# Altium project FlightController.PrjPcb
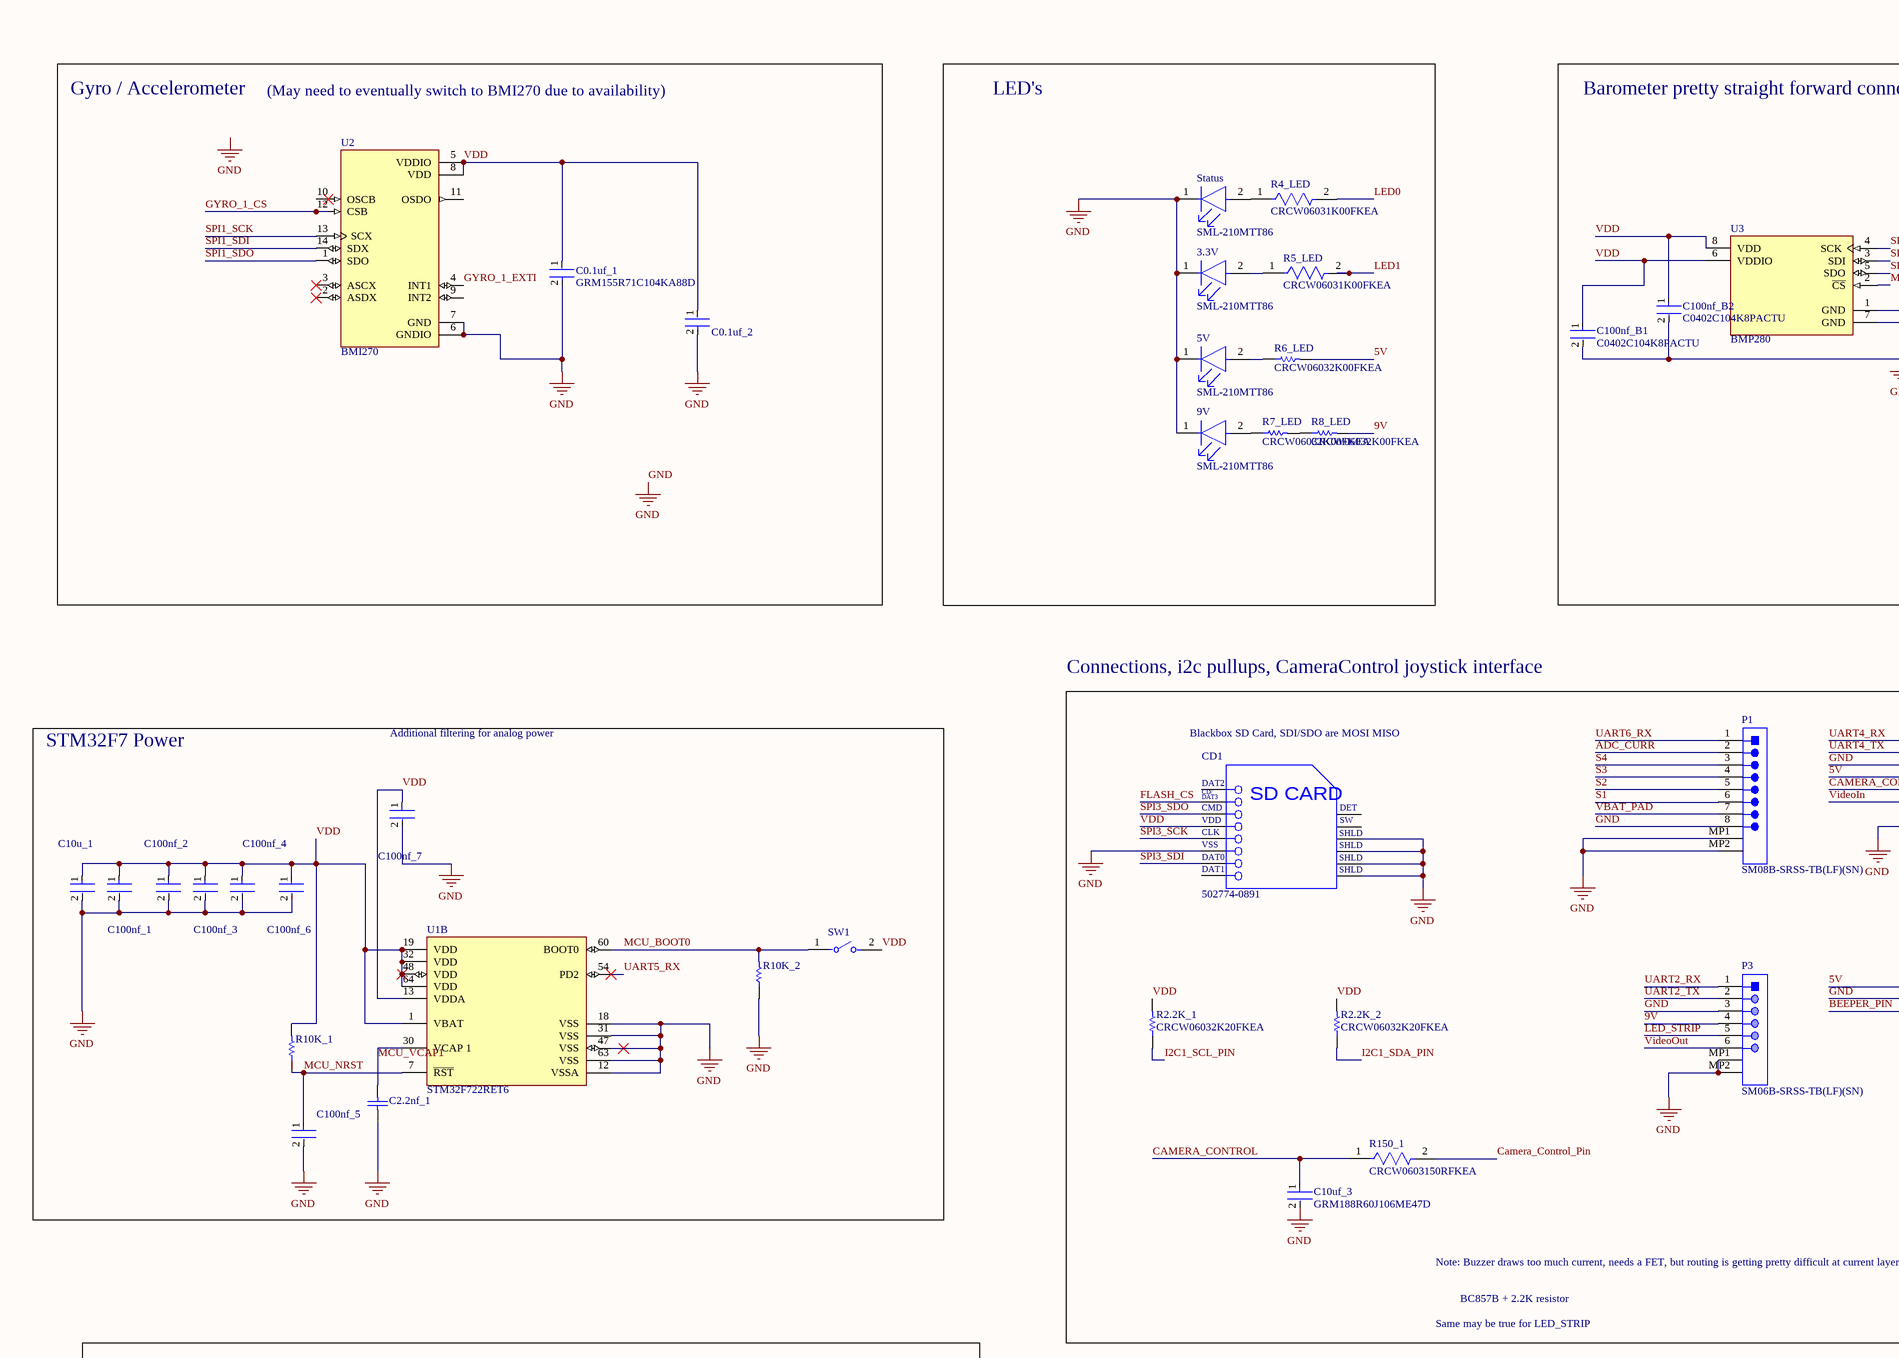
[diagram p0: FlightController.SchDoc, top left]
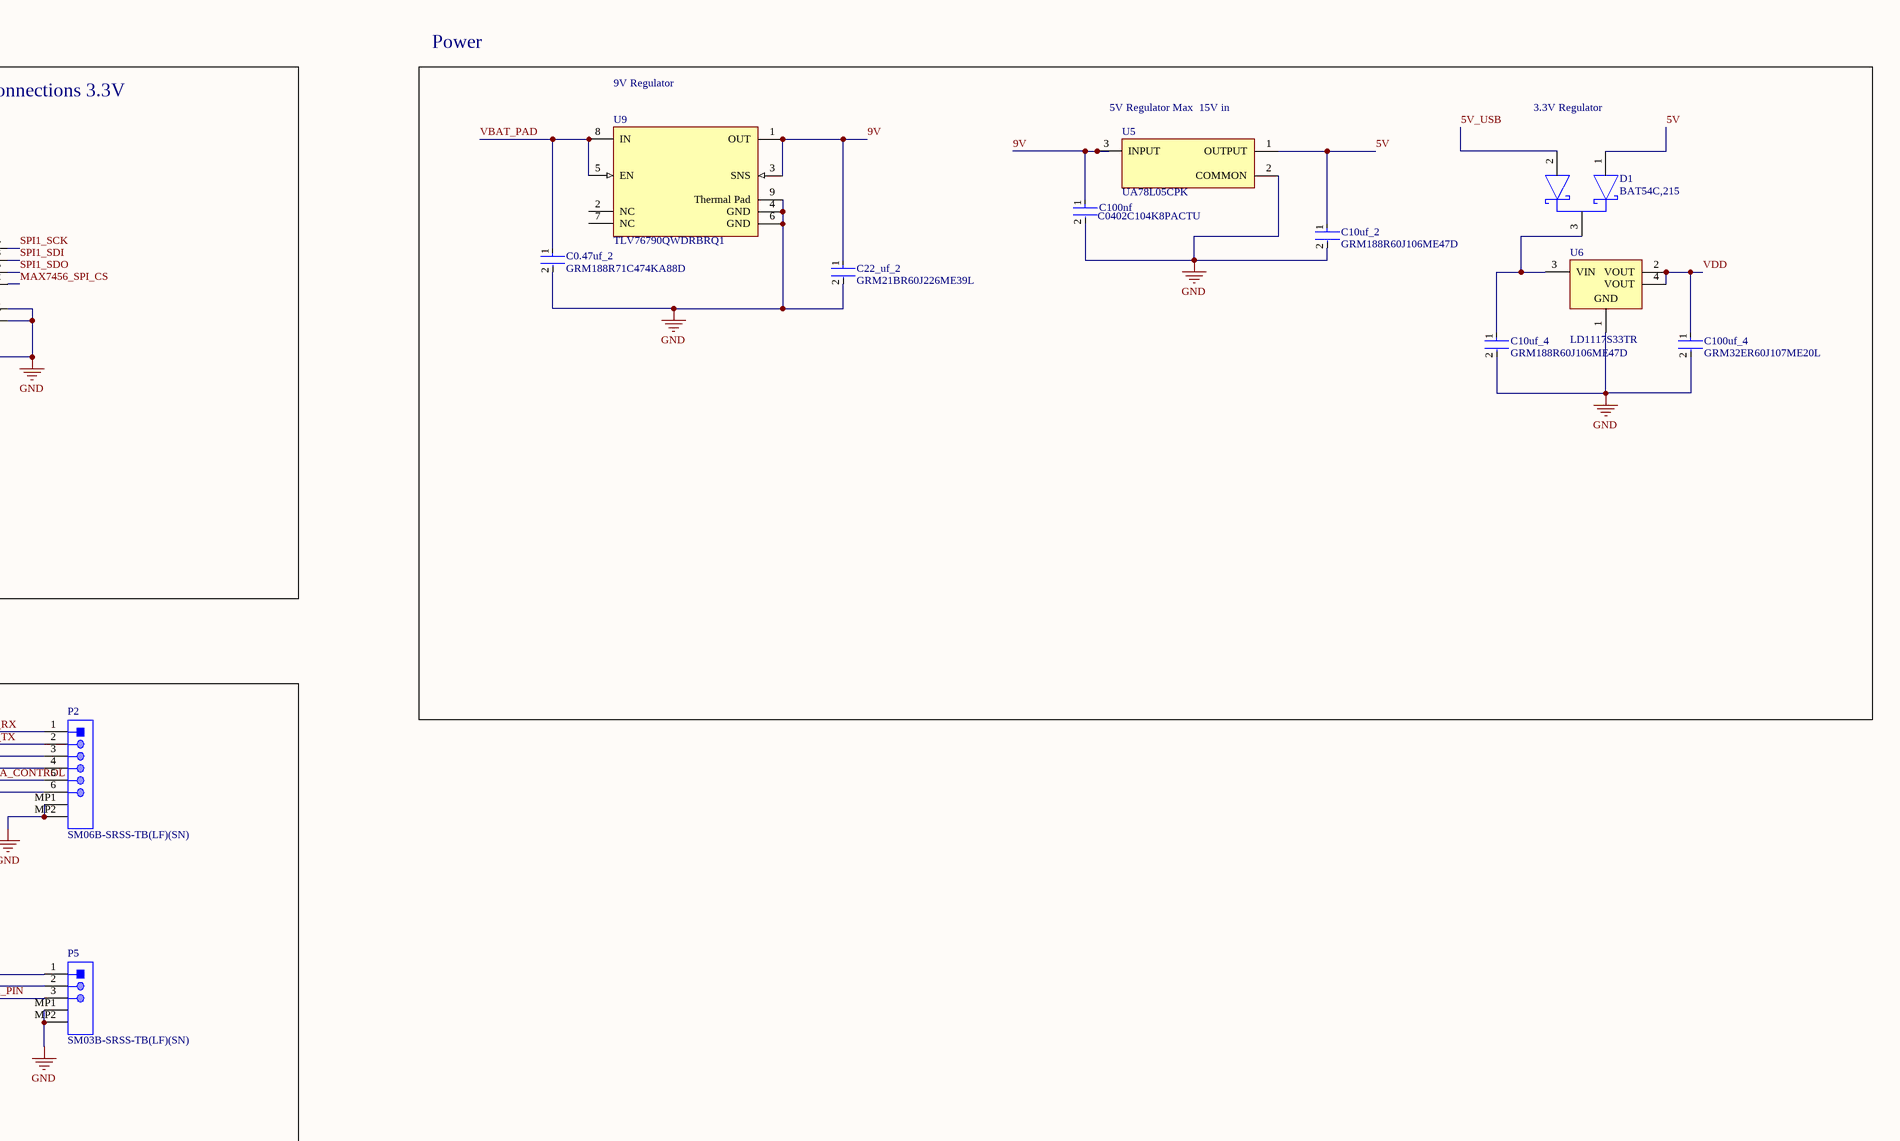
[diagram p1: FlightController.SchDoc, top right]
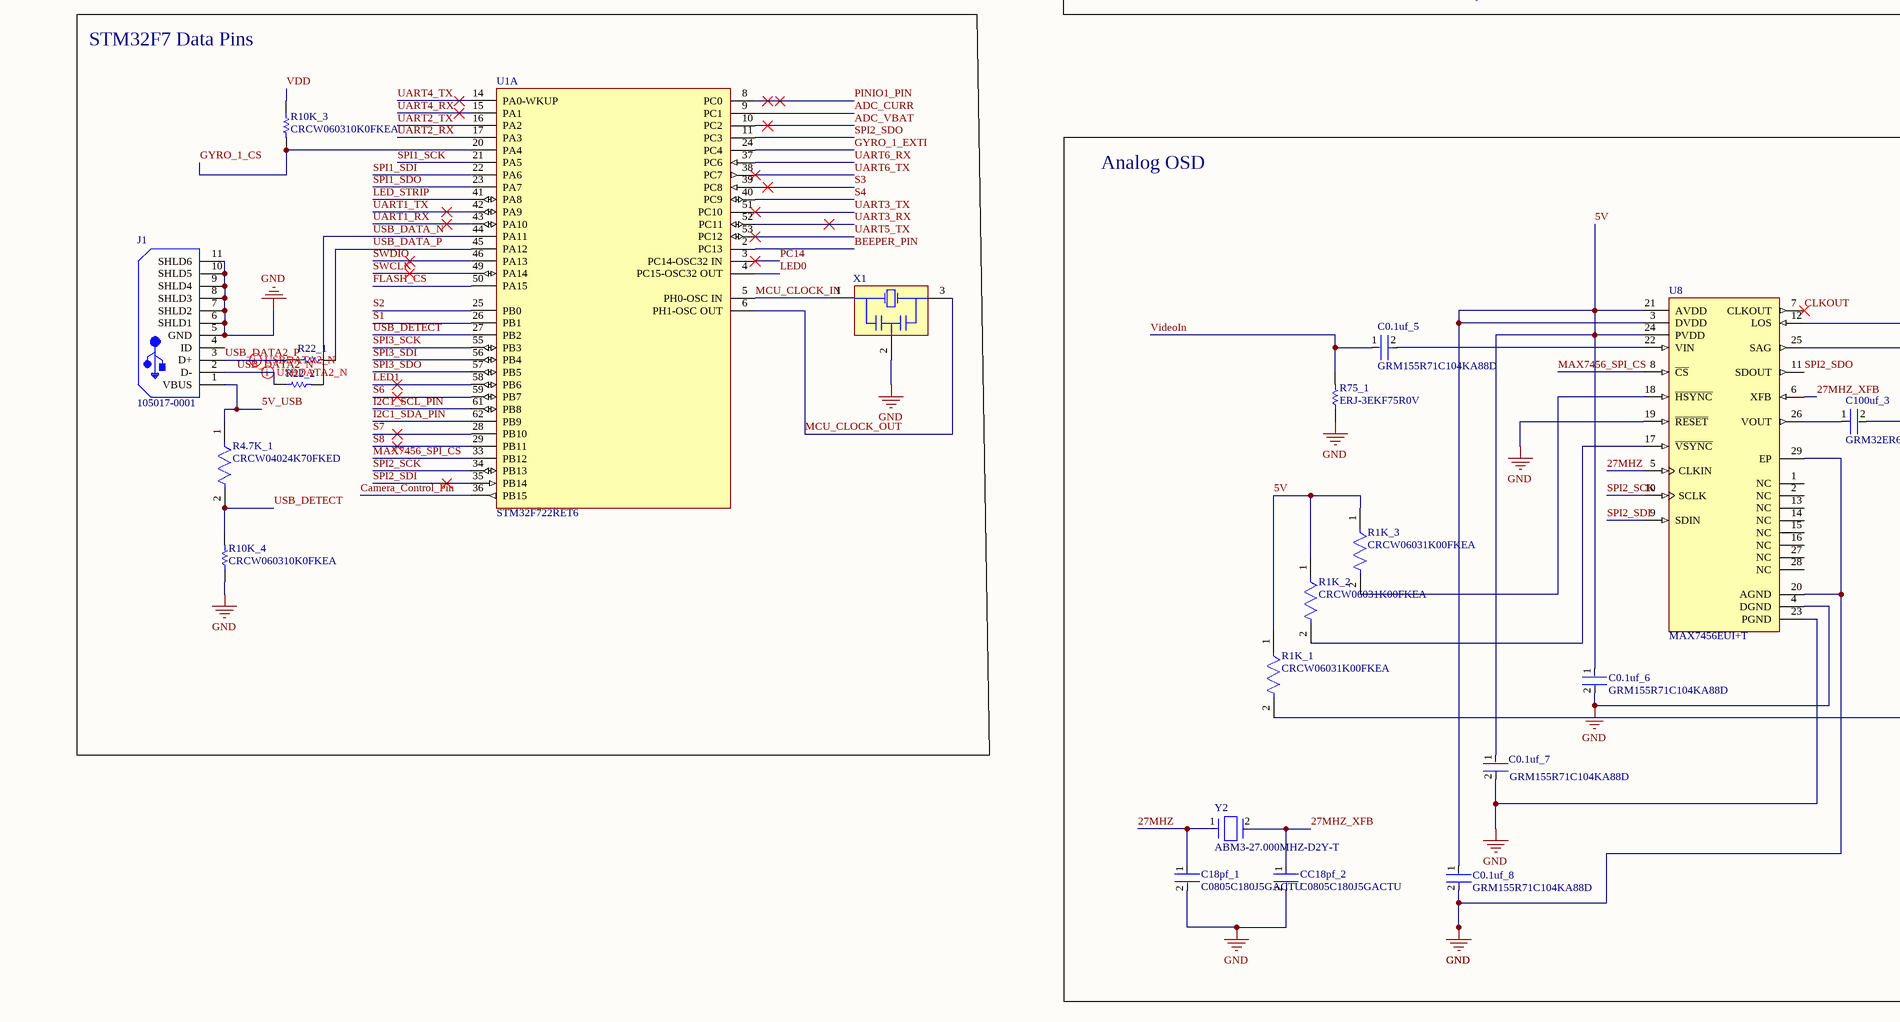
[diagram p2: FlightController.SchDoc, bottom left]
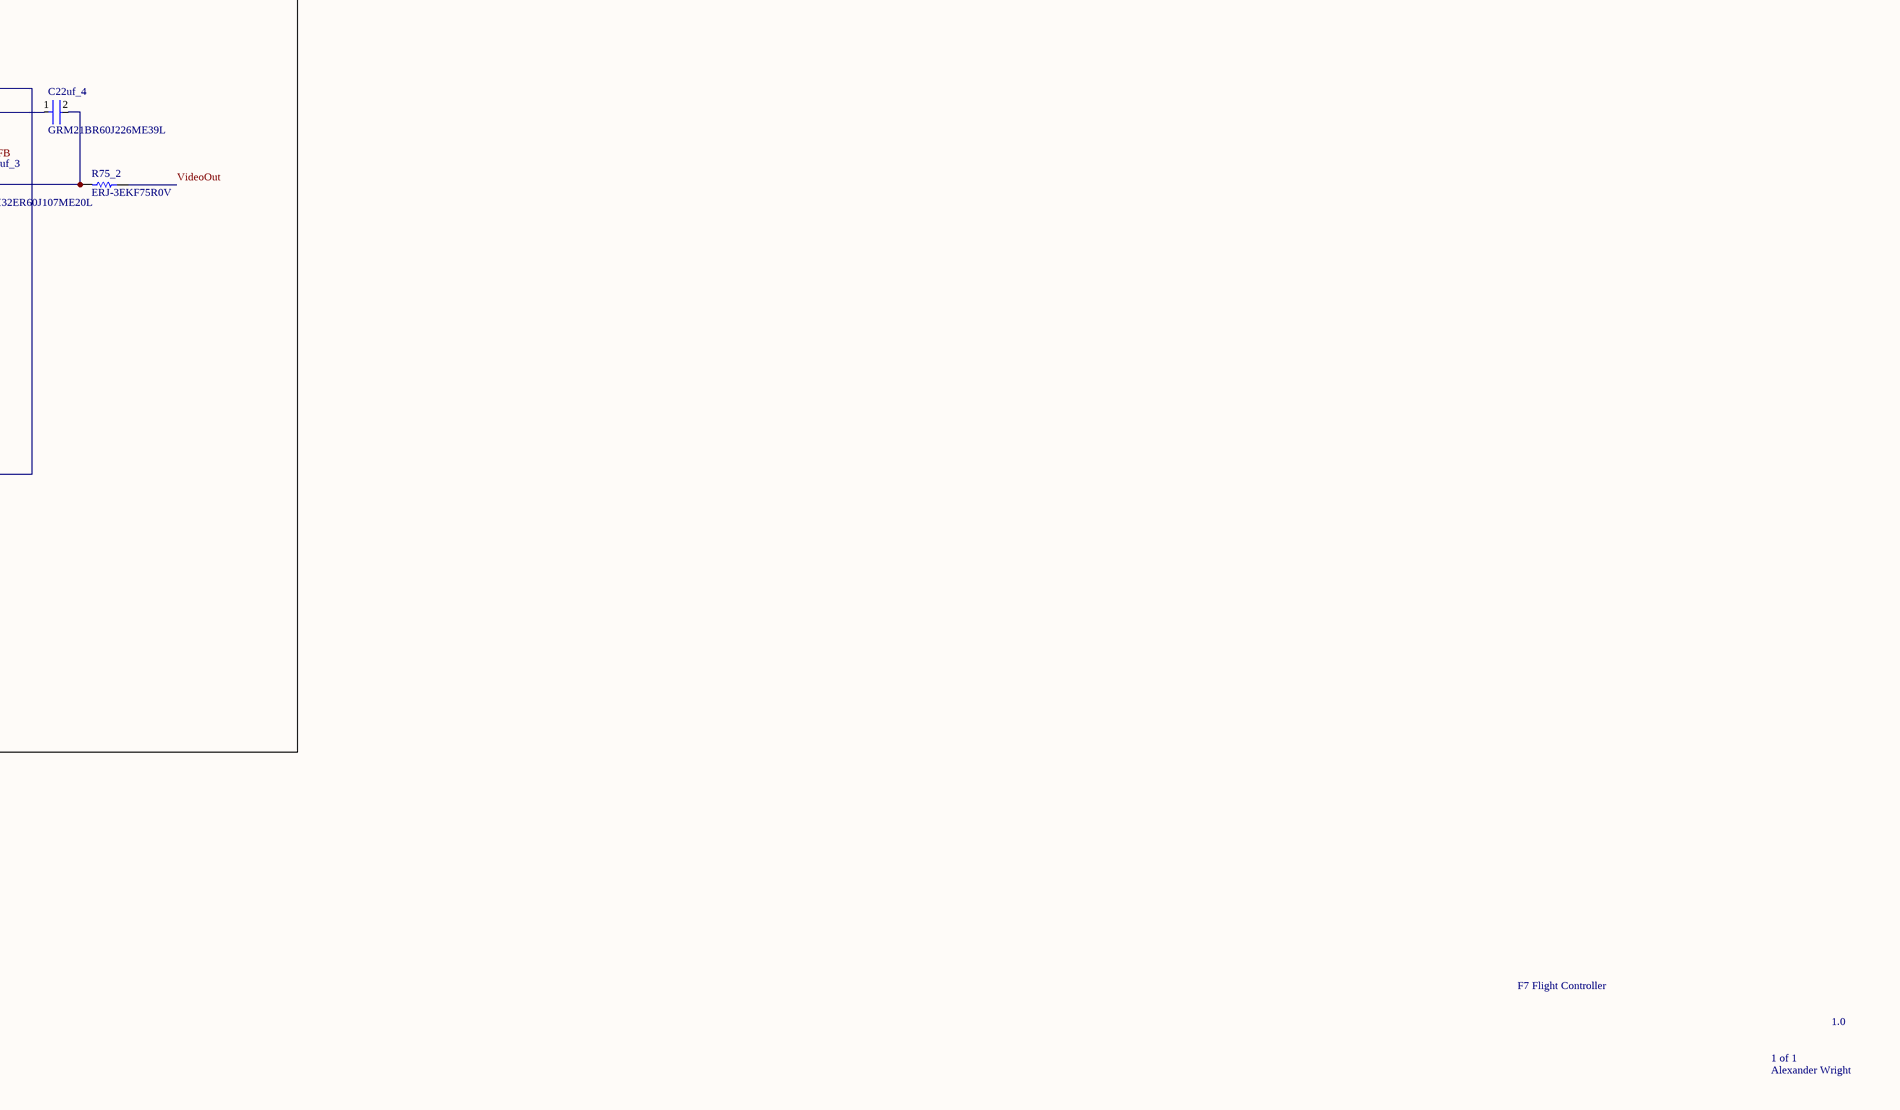
[diagram p3: FlightController.SchDoc, bottom right]
1 sheet, 69 parts. Net scope: global (net labels, ports and power ports of the same name join across sheets).
Board file: PCB1.PcbDoc

## Sheet FlightController.SchDoc
size A1; SheetNumber: 1; SheetTotal: 1

### Parts
3.3V  SML-210MTT86  [FP-SML-210-MFG]
5V  SML-210MTT86  [FP-SML-210-MFG]
9V  SML-210MTT86  [FP-SML-210-MFG]
C0.1uf_1  GRM155R71C104KA88D  [FP-GRM15-MFG]
C0.1uf_2  GRM155R71C104KA88D  [FP-GRM15-MFG]  (value not drawn)
C0.1uf_5  GRM155R71C104KA88D  [FP-GRM15-MFG]
C0.1uf_6  GRM155R71C104KA88D  [FP-GRM15-MFG]
C0.1uf_7  GRM155R71C104KA88D  [FP-GRM15-MFG]
C0.1uf_8  GRM155R71C104KA88D  [FP-GRM15-MFG]
C0.47uf_2  GRM188R71C474KA88D  [FP-GRM188-0_1-e0_2_0_5-IPC_B]
C2.2nf_1  GRM188R71H222KA01D  [CAPC1608X90X35NL10T15]  (value not drawn)
C10u_1  GRM188R60J106ME47D  [FP-GRM188-0_1-e0_2_0_55-IPC_A]  (value not drawn)
C10uf_2  GRM188R60J106ME47D  [FP-GRM188-0_1-e0_2_0_55-IPC_A]
C10uf_3  GRM188R60J106ME47D  [FP-GRM188-0_1-e0_2_0_55-IPC_A]
C10uf_4  GRM188R60J106ME47D  [FP-GRM188-0_1-e0_2_0_55-IPC_A]
C18pf_1  C0805C180J5GACTU  [FP-C0805C-DN-MFG]
C22_uf_2  GRM21BR60J226ME39L  [FP-GRM21B-0_15-MFG]
C22uf_4  GRM21BR60J226ME39L  [FP-GRM21B-0_15-MFG]
C100nf  C0402C104K8PACTU  [FP-C0402-BB-MFG]
C100nf_1  C0402C104K8PACTU  [FP-C0402-BB-MFG]  (value not drawn)
C100nf_2  C0402C104K8PACTU  [FP-C0402-BB-MFG]  (value not drawn)
C100nf_3  C0402C104K8PACTU  [FP-C0402-BB-MFG]  (value not drawn)
C100nf_4  C0402C104K8PACTU  [FP-C0402-BB-MFG]  (value not drawn)
C100nf_5  C0402C104K8PACTU  [FP-C0402-BB-MFG]  (value not drawn)
C100nf_6  C0402C104K8PACTU  [FP-C0402-BB-MFG]  (value not drawn)
C100nf_7  C0402C104K8PACTU  [FP-C0402-BB-MFG]  (value not drawn)
C100nf_B1  C0402C104K8PACTU  [FP-C0402-BB-MFG]
C100nf_B2  C0402C104K8PACTU  [FP-C0402-BB-MFG]
C100uf_3  GRM32ER60J107ME20L  [FP-GRM32-0_3-MFG]
C100uf_4  GRM32ER60J107ME20L  [FP-GRM32-0_3-MFG]
CC18pf_2  C0805C180J5GACTU  [FP-C0805C-DN-MFG]
CD1  502774-0891  [MOLX-502774-0891_V]
D1  BAT54C,215  [FP-SOT23-MFG]
J1  105017-0001  [USB-MICRO-B_V]
P1  SM08B-SRSS-TB(LF)(SN)  [JST-SM08B-SRSS-TB_V]
P2  SM06B-SRSS-TB(LF)(SN)  [JST-SM06B-SRSS-TB_V]
P3  SM06B-SRSS-TB(LF)(SN)  [JST-SM06B-SRSS-TB_V]
P5  SM03B-SRSS-TB(LF)(SN)  [JST-SM03B-SRSS-TB_V]
R1K_1  CRCW06031K00FKEA  [FP-CRCW0603-e3-MFG]
R1K_2  CRCW06031K00FKEA  [FP-CRCW0603-e3-MFG]
R1K_3  CRCW06031K00FKEA  [FP-CRCW0603-e3-MFG]
R2.2K_1  CRCW06032K20FKEA  [RESC1609X50X30NL10T20]
R2.2K_2  CRCW06032K20FKEA  [RESC1609X50X30NL10T20]
R4.7K_1  CRCW04024K70FKED  [FP-CRCW0402-e3-IPC_B]
R4_LED  CRCW06031K00FKEA  [FP-CRCW0603-e3-MFG]
R5_LED  CRCW06031K00FKEA  [FP-CRCW0603-e3-MFG]
R6_LED  CRCW06032K00FKEA  [RESC1609X50X30ML10T20]
R7_LED  CRCW06032K00FKEA  [RESC1609X50X30ML10T20]
R8_LED  CRCW06032K00FKEA  [RESC1609X50X30ML10T20]
R10K_1  CRCW060310K0FKEA  [RESC1609X50X30NL8T20]  (value not drawn)
R10K_2  CRCW060310K0FKEA  [RESC1609X50X30NL8T20]  (value not drawn)
R10K_3  CRCW060310K0FKEA  [RESC1609X50X30NL8T20]
R10K_4  CRCW060310K0FKEA  [RESC1609X50X30NL8T20]
R22_1  CRCW040222R0FKED  [RESC1005X40X25LL05T05]  (value not drawn)
R22_2  CRCW040222R0FKED  [RESC1005X40X25LL05T05]  (value not drawn)
R75_1  ERJ-3EKF75R0V  [RESC1608X55X30LL15T15]
R75_2  ERJ-3EKF75R0V  [RESC1608X55X30LL15T15]
R150_1  CRCW0603150RFKEA  [FP-CRCW0603-e3-MFG]
Status  SML-210MTT86  [FP-SML-210-MFG]
SW1  B3U-1000P-B  [FP-B3U-1000P-B-MFG]  (value not drawn)
U1  STM32F722RET6  [FP-LQFP64-5W-IPC_A]  (parts A,B of 2)
U2  BMI270  [XDCR_BMI270]
U3  BMP280  [FP-BMP280-MFG]
U5  UA78L05CPK  [FP-PK0003A-MFG]
U6  LD1117S33TR  [SOT-223_L]
U8  MAX7456EUI+T  [FP-U28E-5-MFG]
U9  TLV76790QWDRBRQ1  [FP-DRB0008J-IPC_C]
X1  CSTCE8M00G55-R0  [MURA-CSTCE_G_A-3_V]  (value not drawn)
Y2  ABM3-27.000MHZ-D2Y-T  [FP-ABM3-MFG]

### Blocks framed on the sheet
Gyro / Accelerometer: C0.1uf_1 C0.1uf_2 U2
LED's: 3.3V 5V 9V R4_LED R5_LED R6_LED R7_LED R8_LED Status
Barometer pretty straight forward connections 3.3V: C100nf_B1 C100nf_B2 U3
Power: C0.47uf_2 C10uf_2 C10uf_4 C22_uf_2 C100nf C100uf_4 D1 U5 U6 U9
Connections, i2c pullups, CameraControl joystick interface: C10uf_3 CD1 P1-P3 P5 R2.2K_1 R2.2K_2 R150_1
STM32F7 Power: C2.2nf_1 C10u_1 C100nf_1-C100nf_7 R10K_1 R10K_2 SW1 U1
STM32F7 Data Pins: J1 R4.7K_1 R10K_3 R10K_4 R22_1 R22_2 U1 X1
Analog OSD: C0.1uf_5-C0.1uf_8 C18pf_1 C22uf_4 C100uf_3 CC18pf_2 R1K_1-R1K_3 R75_1 R75_2 U8 Y2

### Nets
GND: 3.3V.1(C) 5V.1(C) 9V.1(C) C0.1uf_1.2 C0.1uf_2.2 C0.1uf_6.2 C0.1uf_7.2 C0.1uf_8.2 C0.47uf_2.2 C2.2nf_1.1 C10u_1.2 C10uf_2.2 C10uf_3.2 C10uf_4.2 C18pf_1.2 C22_uf_2.2 C100nf.2 C100nf_1.2 C100nf_2.2 C100nf_3.2 C100nf_4.2 C100nf_5.2 C100nf_6.2 C100nf_7.2 C100nf_B1.2 C100nf_B2.2 C100uf_4.2 CC18pf_2.2 CD1.6(VSS) CD1.11(SHLD) CD1.12(SHLD) CD1.13(SHLD) CD1.14(SHLD) J1.5(GND) J1.6(SHLD1) J1.7(SHLD2) J1.8(SHLD3) J1.9(SHLD4) J1.10(SHLD5) J1.11(SHLD6) P1.8 P1.MP1 P1.MP2 P2.3 P2.MP1 P2.MP2 P3.3 P3.MP1 P3.MP2 P5.2 P5.MP1 P5.MP2 R10K_2.1 R10K_4.1 R75_1.1 Status.1(C) U1.12(VSSA) U1.18(VSS) U1.31(VSS) U1.47(VSS) U1.63(VSS) U2.6(GNDIO) U2.7(GND) U3.1(GND) U3.7(GND) U5.2(COMMON) U6.1(GND) U8.4(DGND) U8.19(~{RESET}) U8.20(AGND) U8.23(PGND) U8.29(EP) U9.4(GND) U9.6(GND) U9.9(Thermal_Pad) X1.2(GND)
5V: C0.1uf_6.1 C0.1uf_7.1 C0.1uf_8.1 C10uf_2.1 D1.1(1_ANODE) P2.4 P5.1 R1K_1.1 R1K_2.1 R1K_3.1 R6_LED.2 U5.1(OUTPUT) U8.3(DVDD) U8.21(AVDD) U8.24(PVDD)
5V_USB: D1.2(2_ANODE) J1.1(VBUS) R4.7K_1.1
9V: C22_uf_2.1 C100nf.1 P3.4 R8_LED.2 U5.3(INPUT) U9.1(OUT) U9.3(SNS)
27MHZ: C18pf_1.1 U8.5(CLKIN) Y2.1
27MHZ_XFB: CC18pf_2.1 U8.6(XFB) Y2.2
ADC_CURR: P1.2 U1.9(PC1)
ADC_VBAT: U1.10(PC2)
BEEPER_PIN: P5.3 U1.2(PC13)
CAMERA_CONTROL: C10uf_3.1 P2.5 R150_1.1
Camera_Control_Pin: R150_1.2 U1.36(PB15)
CLKOUT: U8.7(CLKOUT)
FLASH_CS: CD1.2(CD/DAT3) U1.50(PA15)
GYRO_1_CS: R10K_3.2 U1.20(PA4) U2.12(CSB)
GYRO_1_EXTI: U1.24(PC4) U2.4(INT1)
I2C1_SCL_PIN: R2.2K_1.1 U1.61(PB8)
I2C1_SDA_PIN: R2.2K_2.1 U1.62(PB9)
LED0: R4_LED.2 U1.4(PC15-OSC32_OUT)
LED1: R5_LED.2 U1.58(PB6)
LED_STRIP: P3.5 U1.41(PA8)
MAX7456_SPI_CS: U1.33(PB12) U3.2(~{CS}) U8.8(~{CS})
MCU_BOOT0: R10K_2.2 SW1.1 U1.60(BOOT0)
MCU_CLOCK_IN: U1.5(PH0-OSC_IN) X1.1(X1)
MCU_CLOCK_OUT: U1.6(PH1-OSC_OUT) X1.3(X2)
MCU_NRST: C100nf_5.1 R10K_1.1 U1.7(~{RST})
MCU_VCAP1: C2.2nf_1.2 U1.30(VCAP_1)
PC14: U1.3(PC14-OSC32_IN)
PINIO1_PIN: U1.8(PC0)
S1: P1.6 U1.26(PB1)
S2: P1.5 U1.25(PB0)
S3: P1.4 U1.39(PC8)
S4: P1.3 U1.40(PC9)
S6: U1.59(PB7)
S7: U1.28(PB10)
S8: U1.29(PB11)
SPI1_SCK: U1.21(PA5) U2.13(SCX) U3.4(SCK)
SPI1_SDI: U1.22(PA6) U2.14(SDX) U3.3(SDI)
SPI1_SDO: U1.23(PA7) U2.1(SDO) U3.5(SDO)
SPI2_SCK: U1.34(PB13) U8.10(SCLK)
SPI2_SDI: U1.35(PB14) U8.9(SDIN)
SPI2_SDO: U1.11(PC3) U8.11(SDOUT)
SPI3_SCK: CD1.5(CLK) U1.55(PB3)
SPI3_SDI: CD1.7(DAT0) U1.56(PB4)
SPI3_SDO: CD1.3(CMD) U1.57(PB5)
SWCLK: U1.49(PA14)
SWDIO: U1.46(PA13)
UART1_RX: U1.43(PA10)
UART1_TX: U1.42(PA9)
UART2_RX: P3.1 U1.17(PA3)
UART2_TX: P3.2 U1.16(PA2)
UART3_RX: U1.52(PC11)
UART3_TX: U1.51(PC10)
UART4_RX: P2.1 U1.15(PA1)
UART4_TX: P2.2 U1.14(PA0-WKUP)
UART5_RX: U1.54(PD2)
UART5_TX: U1.53(PC12)
UART6_RX: P1.1 U1.37(PC6)
UART6_TX: U1.38(PC7)
USB_DATA2_N: J1.2(D-) R22_2.1
USB_DATA2_P: J1.3(D+) R22_1.1
USB_DATA_N: R22_2.2 U1.44(PA11)
USB_DATA_P: R22_1.2 U1.45(PA12)
USB_DETECT: R4.7K_1.2 R10K_4.2 U1.27(PB2)
VBAT_PAD: C0.47uf_2.1 P1.7 U9.5(EN) U9.8(IN)
VDD: C0.1uf_1.1 C0.1uf_2.1 C10u_1.1 C100nf_1.1 C100nf_2.1 C100nf_3.1 C100nf_4.1 C100nf_6.1 C100nf_7.1 C100nf_B1.1 C100nf_B2.1 C100uf_4.1 CD1.4(VDD) R2.2K_1.2 R2.2K_2.2 R10K_1.2 R10K_3.1 SW1.2 U1.1(VBAT) U1.13(VDDA) U1.19(VDD) U1.32(VDD) U1.48(VDD) U1.64(VDD) U2.5(VDDIO) U2.8(VDD) U3.6(VDDIO) U3.8(VDD) U6.2(VOUT) U6.4(VOUT)
VideoIn: C0.1uf_5.1 P2.6 R75_1.2
VideoOut: P3.6 R75_2.1
Net3.3V_2: 3.3V.2(A) R5_LED.1
Net5V_2: 5V.2(A) R6_LED.1
Net9V_2: 9V.2(A) R7_LED.1
NetC0.1uf_5_2: C0.1uf_5.2 U8.22(VIN)
NetC10uf_4_1: C10uf_4.1 D1.3(COMMON_CATHODE) U6.3(VIN)
NetC22uf_4_1: C22uf_4.1 U8.25(SAG)
NetC22uf_4_2: C22uf_4.2 C100uf_3.2 R75_2.2
NetC100uf_3_1: C100uf_3.1 U8.26(VOUT)
NetR1K_1_2: R1K_1.2 U8.12(LOS)
NetR1K_2_2: R1K_2.2 U8.17(~{VSYNC})
NetR1K_3_2: R1K_3.2 U8.18(~{HSYNC})
NetR4_LED_1: R4_LED.1 Status.2(A)
NetR7_LED_2: R7_LED.2 R8_LED.1

Not connected (* = marked no-connect by the designer): CD1 1(DAT2) 8(DAT1) 9(DETECT) 10(SWITCH); J1 4(ID); U2 2(ASDX)* 3(ASCX)* 9(INT2) 10(OSCB) 11(OSDO); U8 1(NC) 2(NC) 13(NC) 14(NC) 15(NC) 16(NC) 27(NC) 28(NC); U9 2(NC) 7(NC)

### Layout directives
differential pair: USB_DATA2_N, USB_DATA2_P

### Notes on the sheet
- (May need to eventually switch to BMI270 due to availability)
- 9V Regulator
- (near U5) 5V Regulator Max  15V in
- 3.3V Regulator
- Additional filtering for analog power
- Blackbox SD Card, SDI/SDO are MOSI MISO
- Note: Buzzer draws too much current, needs a FET, but routing is getting pretty difficult at current layer count, so omiting for routing convience
- BC857B + 2.2K resistor
- Same may be true for LED_STRIP
- F7 Flight Controller
- Alexander Wright
- 1 of 1
- 1.0
- Labels drawn without touching a wire or pin: GND
- (in symbol CMP-2000-05248-1) CD/; DAT3; SD CARD; DET; SW

### Library data of the parts
3.3V 5V 9V Status = CMP-08952-000013-1: LED GREEN CLEAR 0805 SMD; Manufacturer: ROHM; Forward Current: 20mA; Reverse Voltage: 4V; Peak Emmision Wavelength: 573nm; Forward Voltage: 2.2V; Luminous Intensity: 16mcd; Power Dissipation: 70mW; Led Orientation: Top View; Wavelength: 570nm; Device Class L2: LEDs; Colour: Green; Height: 0.90mm; Ipc Land Pattern Name: DIOCP200125X25; Manufacturer Part Number: SML-210MTT86; Automotive: No; Temperature Range High: +85°C; Device Class L3: unset; Temperature: -30°C to +85°C; Device Class L1: Optoelectronics; Mouser Description: Standard LEDs - SMD GREEN SMD TRANS LENS; Temperature Range Low: -30°C; Package: SML-210; Digikey Description: LED GREEN CLEAR 0805 SMD; Lead Free: Yes; ComponentLink2URL: https://www.mouser.in/ds/2/348/sml-21-313092.pdf; ComponentLink2Description: Datasheet; Octopart: https://octopart.com/sml-210mtt86-rohm-550711; RoHS: TRUE; Category: Diode
C0.1uf_1 C0.1uf_2 C0.1uf_5-C0.1uf_8 = CMP-2100-03641-2: CAP CER 0.1UF 16V X7R 0402; Manufacturer: Murata; Standoff Height: 0mm; Tolerance: 10%; Voltage Rating: 16Vdc; Material: Ceramic; Capacitance: 0.10μF; Value: 0.10μF; RoHS: TRUE; Manufacturer Part Number: GRM155R71C104KA88D; Temperature Characteristic: X7R; Octopart: https://octopart.com/grm155r71c104ka88d-murata-196880; Digikey Description: CAP CER 0.1UF 16V X7R 0402; Device Class L3: Ceramic Capacitors; Height: 0.55mm; ComponentLink2Description: Datasheet; Temperature Range Low: -55°C; Ipc Land Pattern Name: CAPC10050X219; ComponentLink2URL: https://search.murata.co.jp/Ceramy/image/img/A01X/G101/ENG/GRM155R71H471KA01-01A.pdf; Device Class L1: Passive Components; Lead Free: yes; Category: Cap; Package: GRM15; Temperature: -55°C to +125°C; Device Class L2: Capacitors; Temperature Range High: +125°C; Mouser Description: 0402 0.1 uF 16V ±10 % Tolerance X7R SMT Multilayer Ceramic Capacitor
C0.47uf_2 = CMP-2006-02860-2: Chip Multilayer Ceramic Capacitors for General Purpose, 0603, 0.47uF, X7R, 15%, 10%, 16V; Capacitance: 470nF; Material: Ceramic; Termination: SMD/SMT; Case Code (Imperial): 0603; Height: 0.8mm; Dielectric: X7R; Length: 1.6mm; Packaging: Tape and Reel; Mount: Surface Mount; Thickness: 0.035inch; Voltage Rating (DC): 16V; Case Code (Metric): 1608; REACH SVHC: No SVHC; Depth: 0.8mm; Number of Pins: 2; Max Operating Temperature: 125°C; Min Operating Temperature: -55°C; Width: 0.8mm; Voltage: 16V; Lead Free: Lead Free; Voltage Rating: 16V; Package Quantity: 1; Case/Package: 0603; Tolerance: 10%
C2.2nf_1 = CMP-2006-02908-5: Chip Capacitor, 2.2 nF, +/- 10%, 50 V, -55 to 125 degC, 0603 (1608 Metric), RoHS, Tape and Reel; Manufacturer: Murata; Voltage Rating: 50 V; Pins: 2; Mount: Surface Mount; Max Operating Temperature: 125 degC; ComponentLink1Description: Manufacturer URL; RoHSCompliant: true; PackageDescription: 2-Pin Surface Mount Device, Body 1.6 x 0.8 mm; ComponentLink2URL: http://search.murata.co.jp/Ceramy/image/img/A01X/G101/ENG/GRM188R71H222KA01-01.pdf; PackageReference: 0603; Height: 0.8 mm; Lead Pitch: 4 mm; Packaging: Tape and Reel; DatasheetVersion: 02/2016; Mounting Technology: Surface Mount; ComponentLink2Description: Datasheet; Min Operating Temperature: -55 degC; Length: 1.6 mm; REACH SVHC: No SVHC; Package Quantity: 4000; ComponentLink1URL: http://www.murata.com/
C10u_1 C10uf_2-C10uf_4 = CMP-2006-02792-2: Chip Multilayer Ceramic Capacitors for General Purpose, 0603, 10uF, X5R, 15%, 20%, 6.3V; Packaging: Tape and Reel; Voltage Rating (DC): 6.3V; Width: 0.031inch; Termination: SMD/SMT; Dielectric: X5R; Package Quantity: 4000; Voltage Rating: 6.3V; Capacitance: 10uF; Case/Package: 0603; Min Operating Temperature: -55°C; Voltage: 6.3V; Length: 1.6mm; Thickness: 0.035inch; Lead Free: Lead Free; Depth: 0.8mm; Case Code (Imperial): 0603; Max Operating Temperature: 85°C; Material: Ceramic; Height: 0.8mm; Tolerance: 20%; Mount: Surface Mount; REACH SVHC: No SVHC; Radiation Hardening: No; Case Code (Metric): 1608
C18pf_1 = CMP-2007-00302-2: CAP CER 18PF 50V C0G/NP0 0805; Manufacturer: KEMET; Temperature Characteristic: C0G; Tolerance: 0.05; Description: C0805 18 pF C0G 30ppm/°C 5.00% 50 V; Material: Ceramic; Temperature Coefficient: 30ppm/°C; Device Class L2: Capacitors; Capacitance: 18 pF; Temperature: -55°C to +125°C; Value: 18 pF; Package: C0805C-DN; Mouser Description: Cap Ceramic 18pF 50V C0G 5% SMD 0805 125C Paper T/R; Height: 0.88mm; ComponentLink2URL: https://content.kemet.com/datasheets/KEM_C1003_C0G_SMD.pdf; RoHS: TRUE; Octopart: https://octopart.com/c0805c180j5gactu-kemet-144810; ComponentLink2Description: Datasheet; Temperature Range High: +125°C; Digikey Description: CAP CER 18PF 50V C0G/NP0 0805; Device Class L1: Passive Components; Category: Cap; Automotive: No; Device Class L3: Ceramic Capacitors; Voltage Rating: 50 V; Temperature Range Low: -55°C; Ipc Land Pattern Name: CAPC200125X78; Lead Free: Yes; Manufacturer Part Number: C0805C180J5GACTU
C22_uf_2 C22uf_4 = CMP-2007-03385-2: Chip Multilayer Ceramic Capacitors for General Purpose, 0805, 22uF, X5R, 15%, 20%, 6.3V; Material: Ceramic; Max Operating Temperature: 85°C; Voltage: 6.3V; Min Operating Temperature: -55°C; Case/Package: 0805; Thickness: 0.053inch; Dielectric: X5R; Packaging: Tape and Reel; Depth: 1.25mm; Termination: SMD/SMT; Voltage Rating (DC): 6.3V; Radiation Hardening: No; Tolerance: 20%; Mount: Surface Mount; Lead Free: Lead Free; Package Quantity: 1; REACH SVHC: No SVHC; Voltage Rating: 6.3V; Capacitance: 22uF; Length: 2mm; Case Code (Imperial): 0805; Case Code (Metric): 2012; Width: 0.049inch; Height: 1.25mm
C100nf C100nf_1-C100nf_7 C100nf_B1 C100nf_B2 = CMP-2008-02046-2: CAP CER 0.1UF 10V X5R 0402; Manufacturer: Kemet; Material: Ceramic; Capacitance: 0.10 μF; Temperature Coefficient: 15%; Tolerance: 0.1; Value: 0.10 μF; Package: C0402-BB; Temperature: -55°C to +125°C; ComponentLink2Description: Datasheet; Temperature Characteristic: X5R; Device Class L1: Passive Components; Height: 0.55mm; Lead Free: Yes; ComponentLink2URL: https://content.kemet.com/datasheets/KEM_C1002_X7R_SMD.pdf; Device Class L2: Capacitors; Temperature Range Low: -55°C; Temperature Range High: +125°C; RoHS: TRUE; Octopart: https://octopart.com/c0402c104k8pactu-kemet-140039; Automotive: No; Mouser Description: Capacitor 100 nF 10 VDC 0402; Category: Cap; Voltage Rating: 10 V; Digikey Description: CAP CER 0.1UF 10V X5R 0402; Ipc Land Pattern Name: CAPC10050X50; Device Class L3: Ceramic Capacitors; Manufacturer Part Number: C0402C104K8PACTU
C100uf_3 C100uf_4 = CMP-2000-05259-2: CAP CER 100UF 6.3V X5R 1210; 3DS Part Number: 220-00002; Manufacturer: Murata; Temperature Coefficient: 15%; Material: Ceramic; Tolerance: 20%; Octopart: https://octopart.com/grm32er60j107me20l-murata-197007; ComponentLink2URL: https://search.murata.co.jp/Ceramy/image/img/A01X/G101/ENG/GRM32ER60J107ME20-01.pdf; Temperature Range High: +85°C; RoHS: TRUE; Device Class L3: Ceramic Capacitors; Manufacturer Part Number: GRM32ER60J107ME20L; Device Class L2: Capacitors; Voltage: 6.3V; Package: GRM32-0.3; Voltage Rating: 6.3V; Category: Cap; Device Class L1: Passive Components; Temperature Characteristic: X5R; Automotive: No; Digikey Description: CAP CER 100UF 6.3V X5R 1210; Temperature: -55°C to +85°C; Height: 2.7mm; Ipc Land Pattern Name: CAPC320250X250; Capacitance: 100uF; Temperature Range Low: -55°C; Lead Free: Yes; Value: 100uF; ComponentLink2Description: Datasheet
CC18pf_2 = CMP-2007-00302-2: CAP CER 18PF 50V C0G/NP0 0805; Manufacturer: KEMET; Temperature Characteristic: C0G; Tolerance: 0.05; Description: C0805 18 pF C0G 30ppm/°C 5.00% 50 V; Temperature Coefficient: 30ppm/°C; Device Class L2: Capacitors; Capacitance: 18 pF; Temperature: -55°C to +125°C; Value: 18 pF; Package: C0805C-DN; Mouser Description: Cap Ceramic 18pF 50V C0G 5% SMD 0805 125C Paper T/R; Height: 0.88mm; ComponentLink2URL: https://content.kemet.com/datasheets/KEM_C1003_C0G_SMD.pdf; RoHS: TRUE; Octopart: https://octopart.com/c0805c180j5gactu-kemet-144810; ComponentLink2Description: Datasheet; Temperature Range High: +125°C; Digikey Description: CAP CER 18PF 50V C0G/NP0 0805; Device Class L1: Passive Components; Category: Cap; Automotive: No; Device Class L3: Ceramic Capacitors; Voltage Rating: 50 V; Temperature Range Low: -55°C; Material: Ceramic; Ipc Land Pattern Name: CAPC200125X78; Lead Free: Yes; Manufacturer Part Number: C0805C180J5GACTU
CD1 = CMP-2000-05248-1: Micro SD Memory Card Connector, 0.5 A, 10 V (DC), -25 to 85 degC, 8-Pin SMT, RoHS, Tape and Reel; Manufacturer: Molex; 3D Model: 502774-0891.stp; Online Catalog: microSD™Series; Number of Positions: 10(8+2); Card Type: SecureDigital-microSD™; Insertion, Removal Method: PushIn,PushOut; Other Names: WM24066DKR; Connector Type: ConnectorandEjector; Features: Switch; Family: MemoryConnectors-PCCardSockets; Manufacturer URL: http://www.molex.com/; Mounting Type: SurfaceMount,RightAngle; Contact Finish Thickness: 20µin(0.51µm); Standard Package: 1; Series: 502774; Ejector Side: -; Datasheet Version: Rev. D, 04/2004; Category: Connectors,Interconnects; Contact Finish: Gold; Datasheet URL: https://datasheet.ciiva.com/1104/1499551-1104671.pdf; RoHS Information: 502774-0891CertofCompliance; Mounting Feature: Reverse-Bottom; Packaging: Digi-Reel; Height Above Board: 0.071"(1.80mm); Catalog Drawings: 502774-0891
D1 = CMP-14398-000007-1: DIODE ARRAY SCHOTTKY 30V SOT23; Manufacturer: Nexperia; Automotive Grade: Grade 0; Peak Reverse Current: 2uA; Forward Current: 200mA; Max Surge Forward Current: 600mA; Value: 10pF; Max Junction Temp: +150°C; Lead Free: Yes; Automotive: Yes; Device Class L1: Discrete Semiconductors; Digikey Description: DIODE ARRAY SCHOTTKY 30V SOT23; Reverse Voltage: 30V; ComponentLink2URL: https://assets.nexperia.com/documents/data-sheet/BAT54_SER.pdf; Device Class L2: Diodes; Category: Diode; Octopart: https://octopart.com/bat54c%2C215-nexperia-78738945; Package: SOT23; Mouser Description: Schottky Diodes, Rectifiers - Arrays SOT-23 (TO-236AB) 30V 200mA (DC) Surface Mount; RoHS: TRUE; Manufacturer Part Number: BAT54C,215; Temperature: to +150°C; Ambient Temperature Range Low: -55°C; Height: 1.1mm; Device Class L3: Schottky Diodes; Temperature Range High: +150°C; Footprint Url: https://assets.nexperia.com/documents/outline-drawing/SOT23.pdf; Capacitance: 10pF; Ambient Temperature Range High: +150°C; Ipc Land Pattern Name: SOT95P230X100-3; ComponentLink2Description: Datasheet
J1 = CMP-2000-05827-1: Micro-USB B Receptacle, Right Angle, Bottom Mount, Surface Mount, with Solder Tabs, -30 to 85 degC, 5-Pin USB, RoHS, Tape and Reel; Manufacturer: Molex; Featured Product: Micro-USBConnectorsUSBConnectors; Other Names: WM1399DKR; Package Version: Rev. F, 12/2012; Number of Contacts: 5; Connector Type: USB-microB; Catalog Drawings: 1050170001; 3D Model: 105017-0001.stp; Mating Products: WM17145-ND-CABLEMICROUSBBTOSTDA1.0MWM17147-ND-CABLEMICROUSBBTOSTDA2.0MWM17146-ND-CABLEMICROUSBBTOSTDA1.5M; PCN Assembly/Origin: ResinSupplier21/Oct/2015; Voltage - Max: 30V; Online Catalog: Molex-MicroUSB; Manufacturer URL: http://www.molex.com/; Package Description: 5-Leads USB, Micro B, Body 7.5 x 5 mm, Pitch 0.65 mm; Datasheet URL: http://www.molex.com/elqNow/elqRedir.htm?ref=http://www.molex.com/webdocs/datasheets/pdf/en-us/1050170001_IO_CONNECTORS.pdf; Ingress Protection: -; Datasheet Version: 03/2016; Mounting Type: BoardCutout,SurfaceMount,RightAngle; Circuits: 5; Standard Package: 1; Package Reference: MICRO-B; Package URL: http://www.molex.com/pdm_docs/sd/1050170001_sd.pdf; Category: Connectors,Interconnects; Series: -; RoHS Information: 1050170001CertofCompliance; Features: Shielded,SolderRetention; Family: USB,DVI,HDMIConnectors; Specifications: -; Gender: Receptacle; Packaging: Digi-Reel®; Mounting Technology: SurfaceMount
P1 = CMP-2000-07082-1: Male Header, Pitch 1 mm, 1 x 8 Position, Height 2.95 mm, -25 to 85 degC, RoHS, Tape and Reel; Manufacturer: JST; Style/Orientation: RightAngleHeader/Plug; Pitch: 1mm; No of Positions: 8; Manufacturer URL: http://www.jst.com/home2.html; Mounting Technology: SurfaceMount; Package Description: Male Header, Pitch 1 mm, 1 x 8 Position, Height 2.95 mm; Datasheet URL: http://www.jst-mfg.com/product/pdf/eng/eSR.pdf; Type: ShroudedHeader; Termination: Crimp; Package Reference: SM08B-SRSS-TB; Datasheet Version: 11/2010
P2 P3 = CMP-2000-07080-1: Male Header, Pitch 1 mm, 1 x 6 Position, Height 2.95 mm, -25 to 85 degC, RoHS, Tape and Reel; Manufacturer: JST; No of Positions: 6; Pitch: 1mm; Style/Orientation: RightAngleHeader/Plug; Datasheet URL: https://datasheet.ciiva.com/26894/getdatasheetpartid-708885-26894671.pdf; Package Description: Male Header, Pitch 1 mm, 1 X 6 Position, Height 2.9 mm; Termination: Solder; Manufacturer URL: http://www.jst.com/home2.html; Type: ShroudedHeader; Package Reference: SM06B-SRSS-TB; Datasheet Version: 11/2010; Mounting Technology: SurfaceMount
P5 = CMP-2000-07077-1: Male Header, Pitch 1 mm, 1 x 3 Position, Height 2.9 mm, -25 to 85 degC, RoHS, Tape and Reel; Manufacturer: JST; Pitch: 1mm; Style/Orientation: RightAngleHeader/Plug; No of Positions: 3; Package Description: Male Header, Pitch 1 mm, 1 x 3 Position, Height 2.9 mm; Manufacturer URL: http://www.jst.com/home2.html; Package Reference: SM03B-SRSS-TB; Type: ShroudedHeader; Termination: Crimp; Mounting Technology: SurfaceMount; Datasheet Version: 11/2010; Datasheet URL: https://datasheet.ciiva.com/26894/getdatasheetpartid-708885-26894671.pdf
R1K_1-R1K_3 R4_LED R5_LED = CMP-1666-00003-5: RES Thick Film, 1kΩ, 1%, 0.1W, 100ppm/°C, 0603; Max Power Dissipation: 100mW; Voltage Rating: 75V; Resistance: 1kR; Max Operating Temperature: 155°C; Number of Pins: 2; Case Code (Imperial): 0603; Width: 0.033inch; Power Rating: 100mW; Number of Terminations: 2; Package Quantity: 10; Weight: 7.1E-05oz; Tolerance: 1%; Temperature Coefficient: 100ppm/°C; Military Standard: Not; Mount: Surface Mount; Voltage Rating (DC): 75V; Depth: 0.85mm; Composition: Thick Film; Radiation Hardening: No; Termination: SMD/SMT; Length: 1.55mm; Case Code (Metric): 1608; Contact Plating: Tin; Min Operating Temperature: -55°C; Packaging: Tape and Reel; Height: 0.45mm; Lead Free: Lead Free; Case/Package: 0603; Features: Automotive AEC-Q200
R2.2K_1 R2.2K_2 = CMP-2000-03167-1: Manufacturer: Vishay Dale; Part Number: CRCW06032K20FKEA
R4.7K_1 = CMP-2002-00051-3: RES Thick Film, 4.7kΩ, 1%, 0.063W, 100ppm/°C, 0402; Voltage Rating (DC): 50V; Power Rating: 63mW; Resistance: 4.7kR; Termination: SMD/SMT; Military Standard: Not; Length: 1mm; Radiation Hardening: No; Max Operating Temperature: 155°C; Min Operating Temperature: -55°C; Package Quantity: 10; Width: 0.5mm; Case Code (Imperial): 0402; Number of Terminations: 2; Max Power Dissipation: 63mW; Tolerance: 1%; Features: Automotive AEC-Q200; Composition: Thick Film; Depth: 0.5mm; Mount: Surface Mount; Weight: 2.3E-05oz; Lead Free: Lead Free; Case/Package: 0402; Height: 0.35mm; Packaging: Tape and Reel; Temperature Coefficient: 100ppm/°C; Case Code (Metric): 1005; Voltage Rating: 50V; Contact Plating: Tin
R6_LED R7_LED R8_LED = CMP-2000-03159-1: Manufacturer: Vishay Dale; Part Number: CRCW06032K00FKEA
R10K_1-R10K_4 = CMP-1666-00005-4: Chip Resistor, 10 KOhm, +/- 1%, 100 mW, -55 to 155 degC, 0603 (1608 Metric), RoHS, Tape and Reel; Manufacturer: Vishay Semiconductor; Voltage Rating: 75 V; Max Operating Temperature: 155 degC; PackageDescription: 2-Pin Surface Mount Device, Body 1.575 x 0.85 mm; ComponentLink1Description: Manufacturer URL; RoHSCompliant: true; PackageReference: 0603; REACH SVHC: Unknown; Length: 1.55 mm; DatasheetVersion: 06/2012; Packaging: Tape and Reel; Min Operating Temperature: -55 degC; Mounting Technology: Surface Mount; ComponentLink2URL: https://datasheet.ciiva.com/11809/0900766b80d98afc-11809037.pdf; Height: 0.45 mm; ComponentLink2Description: Datasheet; Package Quantity: 5000; ComponentLink1URL: http://www.vishay.com/
R22_1 R22_2 = CMP-2002-08382-1: Manufacturer: Vishay Dale; Part Number: CRCW040222R0FKED
R75_1 R75_2 = CMP-2000-00639-1: Manufacturer: Panasonic; Part Number: ERJ-3EKF75R0V
R150_1 = CMP-2000-03913-2: RES Thick Film, 150Ω, 1%, 0.1W, 100ppm/°C, 0603; Voltage Rating (DC): 75V; Resistance: 150R; Max Power Dissipation: 100mW; Features: Automotive AEC-Q200; Weight: 7.1E-05oz; Number of Terminations: 2; Temperature Coefficient: 100ppm/°C; Military Standard: Not; Length: 1.55mm; Min Operating Temperature: -55°C; Termination: SMD/SMT; Tolerance: 1%; Composition: Thick Film; Depth: 0.85mm; Max Operating Temperature: 155°C; Width: 0.033inch; Lead Free: Lead Free; Height: 0.45mm; Case Code (Metric): 1608; Package Quantity: 10; Case Code (Imperial): 0603; Voltage Rating: 75V; Radiation Hardening: No; Contact Plating: Tin; Mount: Surface Mount; Packaging: Tape and Reel; Power Rating: 100mW; Case/Package: 0603
SW1 = CMP-08834-000005-1: SWITCH TACTILE SPST-NO 0.05A 12V; Manufacturer: Omron; Operating Force: 1.5N; Contact Current Rating: 50mA; Contact Resistance: 100mΩ; Electromechanical Life: 200000Cycles; Height: 1.75mm; Device Class L2: Switches; Temperature Range High: +70°C; Digikey Description: SWITCH TACTILE SPST-NO 0.05A 12V; Throw Configuration: SPST-NO; Ambient Temperature Range High: +70°C; Temperature: -25°C to +70°C; Lead Free: Yes; ComponentLink2URL: https://omronfs.omron.com/en_US/ecb/products/pdf/en-b3u.pdf; Device Class L3: Tactile Switches; Manufacturer Part Number: B3U-1000P-B; Ambient Temperature Range Low: -25°C; Mount: Surface Mount; Automotive: No; Mouser Description: Tactile Switches Top Actuated with boss w/o ground; Octopart: https://octopart.com/b3u-1000p-b-omron-1057356; RoHS: TRUE; Package: 0; Device Class L1: Electromechanical; Voltage Rating Dc: 12V; Category: Switch; Temperature Range Low: -25°C; ComponentLink2Description: Datasheet
U1 = CMP-12105-000139-1: IC MCU 32BIT 512KB FLASH 64LQFP; Interface: I2C; Number of I/Os: 50; Peripherals: Brown-out Detect/Reset; Core Architecture: ARM; Oscillator Type: Internal; Frequency: 216MHz; Memory Size: 512KB; Min Operating Temperature: -40°C; Max Operating Temperature: 85°C; Mount: Surface Mount; Case/Package: LQFP; Memory Type: FLASH; Packaging: Tray
U2 = CMP-010-00024-1: Accelerometer, Gyroscope, 6 Axis Sensor IÂ²C, SPI Output; MF: Bosch Sensortec; Case/Package: LGA-14 Bosch Sensortec; MP: BMI270; Component Type: Standard; Design Item ID: BMI270; Digi-Key_Part_Number: 828-1091-2-ND; Source: BMI270.SchLib; Purchase-URL: https://pricing.snapeda.com/search/part/BMI270/?ref=eda; SnapEDA_Link: https://www.snapeda.com/parts/BMI270/Bosch+Sensortec/view-part/?ref=snap; Value: *; Pins: 14; Check_prices: https://www.snapeda.com/parts/BMI270/Bosch+Sensortec/view-part/?ref=eda
U3 = CMP-2000-05076-3: SENSOR PRESSURE ABS; Operating Pressure: 15.95PSI; Pressure Type: Absolute; Output Type: SPI; Max Pressure: 290.08PSI; Port Style: No Port; Case/Package: SMD/SMT; Lead Free: Lead Free; Termination: SMD/SMT; Min Operating Temperature: -40°C; Number of Pins: 8; Max Operating Temperature: 85°C
U5 = CMP-2000-07341-2: IC REG LINEAR 5V 100MA SOT89-3; Manufacturer: Texas Instruments; Min Supply Voltage: 7V; Accuracy Percentage: 3.75%; Dropout Voltage: 1.7V; Number Of Outputs: 1; Nominal Supply Current: 3.8mA; Max Supply Voltage: 20V; Output Type: Fixed; Max Junction Temp: +125°C; Digikey Description: IC REG LINEAR 5V 100MA SOT89-3; RoHS: TRUE; ComponentLink2URL: https://www.ti.com/lit/ds/symlink/ua78l.pdf; Package: PK0003A; Temperature Range High: +125°C; Device Class L2: Power Management ICs; Manufacturer Part Number: UA78L05CPK; ComponentLink2Description: Datasheet; Category: IC; Lead Free: Yes; Automotive: No; Temperature Range Low: 0°C; Output Current: 100mA; Mouser Description: 100-mA, 30-V VIN, Positive-Voltage Linear Regulators 3-SOT-89 0 to 125; Device Class L3: Voltage Regulators - Linear; Device Class L1: Integrated Circuits (ICs); Temperature: 0°C to +125°C; Output Voltage: 5V; Height: 1.6mm; Octopart: https://octopart.com/ua78l05cpk-texas+instruments-525289
U6 = CMP-0244-00310-1: Fixed Low Drop Positive Voltage Regulator, 3.3V, 4-Pin SOT-223, Tape and Reel; ComponentLink2Description: Datasheet; PackageDescription: 4-Pin SOT-223 Package, 6.5 x 3.5 mm Body, 2.3 mm Pitch, 7 mm Lead Span; PackageVersion: 2010; ComponentLink2URL: http://www.st.com/internet/com/TECHNICAL_RESOURCES/TECHNICAL_LITERATURE/DATASHEET/CD00000544.pdf; PackageReference: SOT-223; DatasheetVersion: 1/11/2011; ComponentLink1Description: Manufacturer URL; ComponentLink1URL: http://www.st.com
U8 = CMP-05676-000004-1: IC DISPLAY 1CH W/EEPROM 28TSSOP; Obsolete Part: true; Manufacturer: Maxim Integrated; Nominal Supply Current: 24-58mA; Min Supply Voltage: 4.75V; Max Supply Voltage: 5.25V; Max Junction Temp: +150°C; Standoff Height: 0.05mm; Interface: SPI; Temperature Range High: +85°C; Package: U28E-5; Octopart: https://octopart.com/max7456eui%2Bt-maxim+integrated-42626431; Device Class L3: unset; ComponentLink2Description: Datasheet; Digikey Description: IC DISPLAY 1CH W/EEPROM 28TSSOP; Temperature: -40°C to +85°C; Automotive: No; Ipc Land Pattern Name: SOP65P638X110-28; Device Class L2: Interface ICs; Lead Free: Yes; RoHS: TRUE; Manufacturer Part Number: MAX7456EUI+T; ComponentLink2URL: https://datasheets.maximintegrated.com/en/ds/MAX7456.pdf; Footprint Url: https://pdfserv.maximintegrated.com/package_dwgs/21-0108.PDF; Height: 1.1mm; Temperature Range Low: -40°C; Device Class L1: Integrated Circuits (ICs); Category: IC
U9 = CMP-04917-000367-1: IC OPAMP; RoHS Compliant: Yes
X1 = CMP-2100-03620-1: Ceramic Resonator, 8 MHz, +/- 0.5%, -20 to 80 degC, 3-Pin SMD, RoHS, Tape and Reel; Manufacturer: Murata; Capacitance: 33pF; Frequency Stability: 0.2%; Self Resonant Frequency: 8MHz; Datasheet Version: 42339.0; RoHSCompliant: True; Datasheet URL: http://www.murata.com/~/media/webrenewal/support/library/catalog/products/timingdevice/ceralock/p16e.ashx; Case/Package: Ceramic; Load Capacitance: 33pF; Tolerance: 0.5%; Mount: SurfaceMount; Height: 0.031inch; Number of Pins: 3; Package Description: 3-Pin Surface Mount Device, Body 3.2 x 1.3 mm, Pitch 1.2 mm; Package Quantity: 1; Lead Free: LeadFree; Contact Plating: Gold; REACH SVHC: NoSVHC; Length: 0.126inch; Width: 0.051inch; Manufacturer URL: http://www.murata.com/; Packaging: TapeandReel; Termination: SMD/SMT; Frequency Tolerance: 0.5%; Max Operating Temperature: 80degC; Composition: Ceramic; Package Reference: CSTCE_G_A-3; Min Operating Temperature: -20degC; Frequency: 8MHz
Y2 = CMP-27762-013610-1: Crystal 27MHz ±20ppm 18pF SMD-2 5mm x 3.2mm; Series Resistance: 30R; Frequency Stability: 30ppm; Package Quantity: 1000; Mount: Surface Mount; Height: 0.051inch; Lead Free: Lead Free; Frequency: 27MHz; Load Capacitance: 18pF; REACH SVHC: No SVHC; Termination: SMD/SMT; Tolerance: 20ppm; Depth: 3.2mm; Case/Package: SMD/SMT; Number of Pins: 2; Frequency Tolerance: 20ppm; Series: ABM3; Max Operating Temperature: 85°C; Packaging: Tape and Reel; ESR (Equivalent Series Resistance): 30R; Min Operating Temperature: -40°C; Resistor Type: Ceramic; RoHS Compliant: Yes; Length: 5mm; Width: 0.126inch